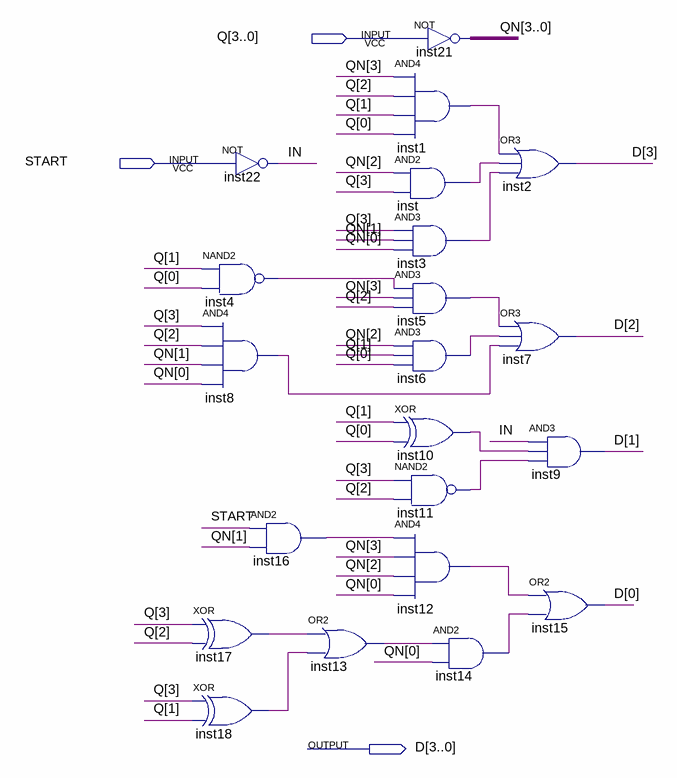
[diagram p0: schematic sheet]
// Quartus schematic NEXTSTATE.bdf as structural Verilog: 21 symbols, 3 pins
module NEXTSTATE (
  input  [3:0] Q,
  input  START,
  output [3:0] D
);

  wire IN, inst1_out, inst3_out, inst4_out, inst5_out, inst6_out, inst8_out, inst10_out, inst11_out,
       inst12_out, inst13_out, inst14_out, inst16_out, inst17_out, inst18_out, inst_out;
  wire [3:0] QN;

  not inst22 (IN, START);
  nand inst4 (inst4_out, Q[1], Q[0]);
  and inst8 (inst8_out, Q[3], Q[2], QN[1], QN[0]);
  and inst16 (inst16_out, START, QN[1]);
  xor inst17 (inst17_out, Q[3], Q[2]);
  xor inst18 (inst18_out, Q[3], Q[1]);
  or inst13 (inst13_out, inst17_out, inst18_out);
  assign QN = ~Q;  // NOT inst21, 4 bits wide
  and inst1 (inst1_out, QN[3], Q[2], Q[1], Q[0]);
  and inst (inst_out, QN[2], Q[3]);
  and inst3 (inst3_out, Q[3], QN[1], QN[0]);
  and inst5 (inst5_out, inst4_out, QN[3], Q[2]);
  and inst6 (inst6_out, QN[2], Q[1], Q[0]);
  xor inst10 (inst10_out, Q[1], Q[0]);
  nand inst11 (inst11_out, Q[3], Q[2]);
  and inst12 (inst12_out, inst16_out, QN[3], QN[2], QN[0]);
  and inst14 (inst14_out, inst13_out, QN[0]);
  or inst2 (D[3], inst1_out, inst_out, inst3_out);
  or inst7 (D[2], inst5_out, inst6_out, inst8_out);
  and inst9 (D[1], IN, inst10_out, inst11_out);
  or inst15 (D[0], inst12_out, inst14_out);
endmodule
